# EAGLE design MCP23017_Aufsatz_Verzweiger_V2.1 (EAGLE 9.6.2)
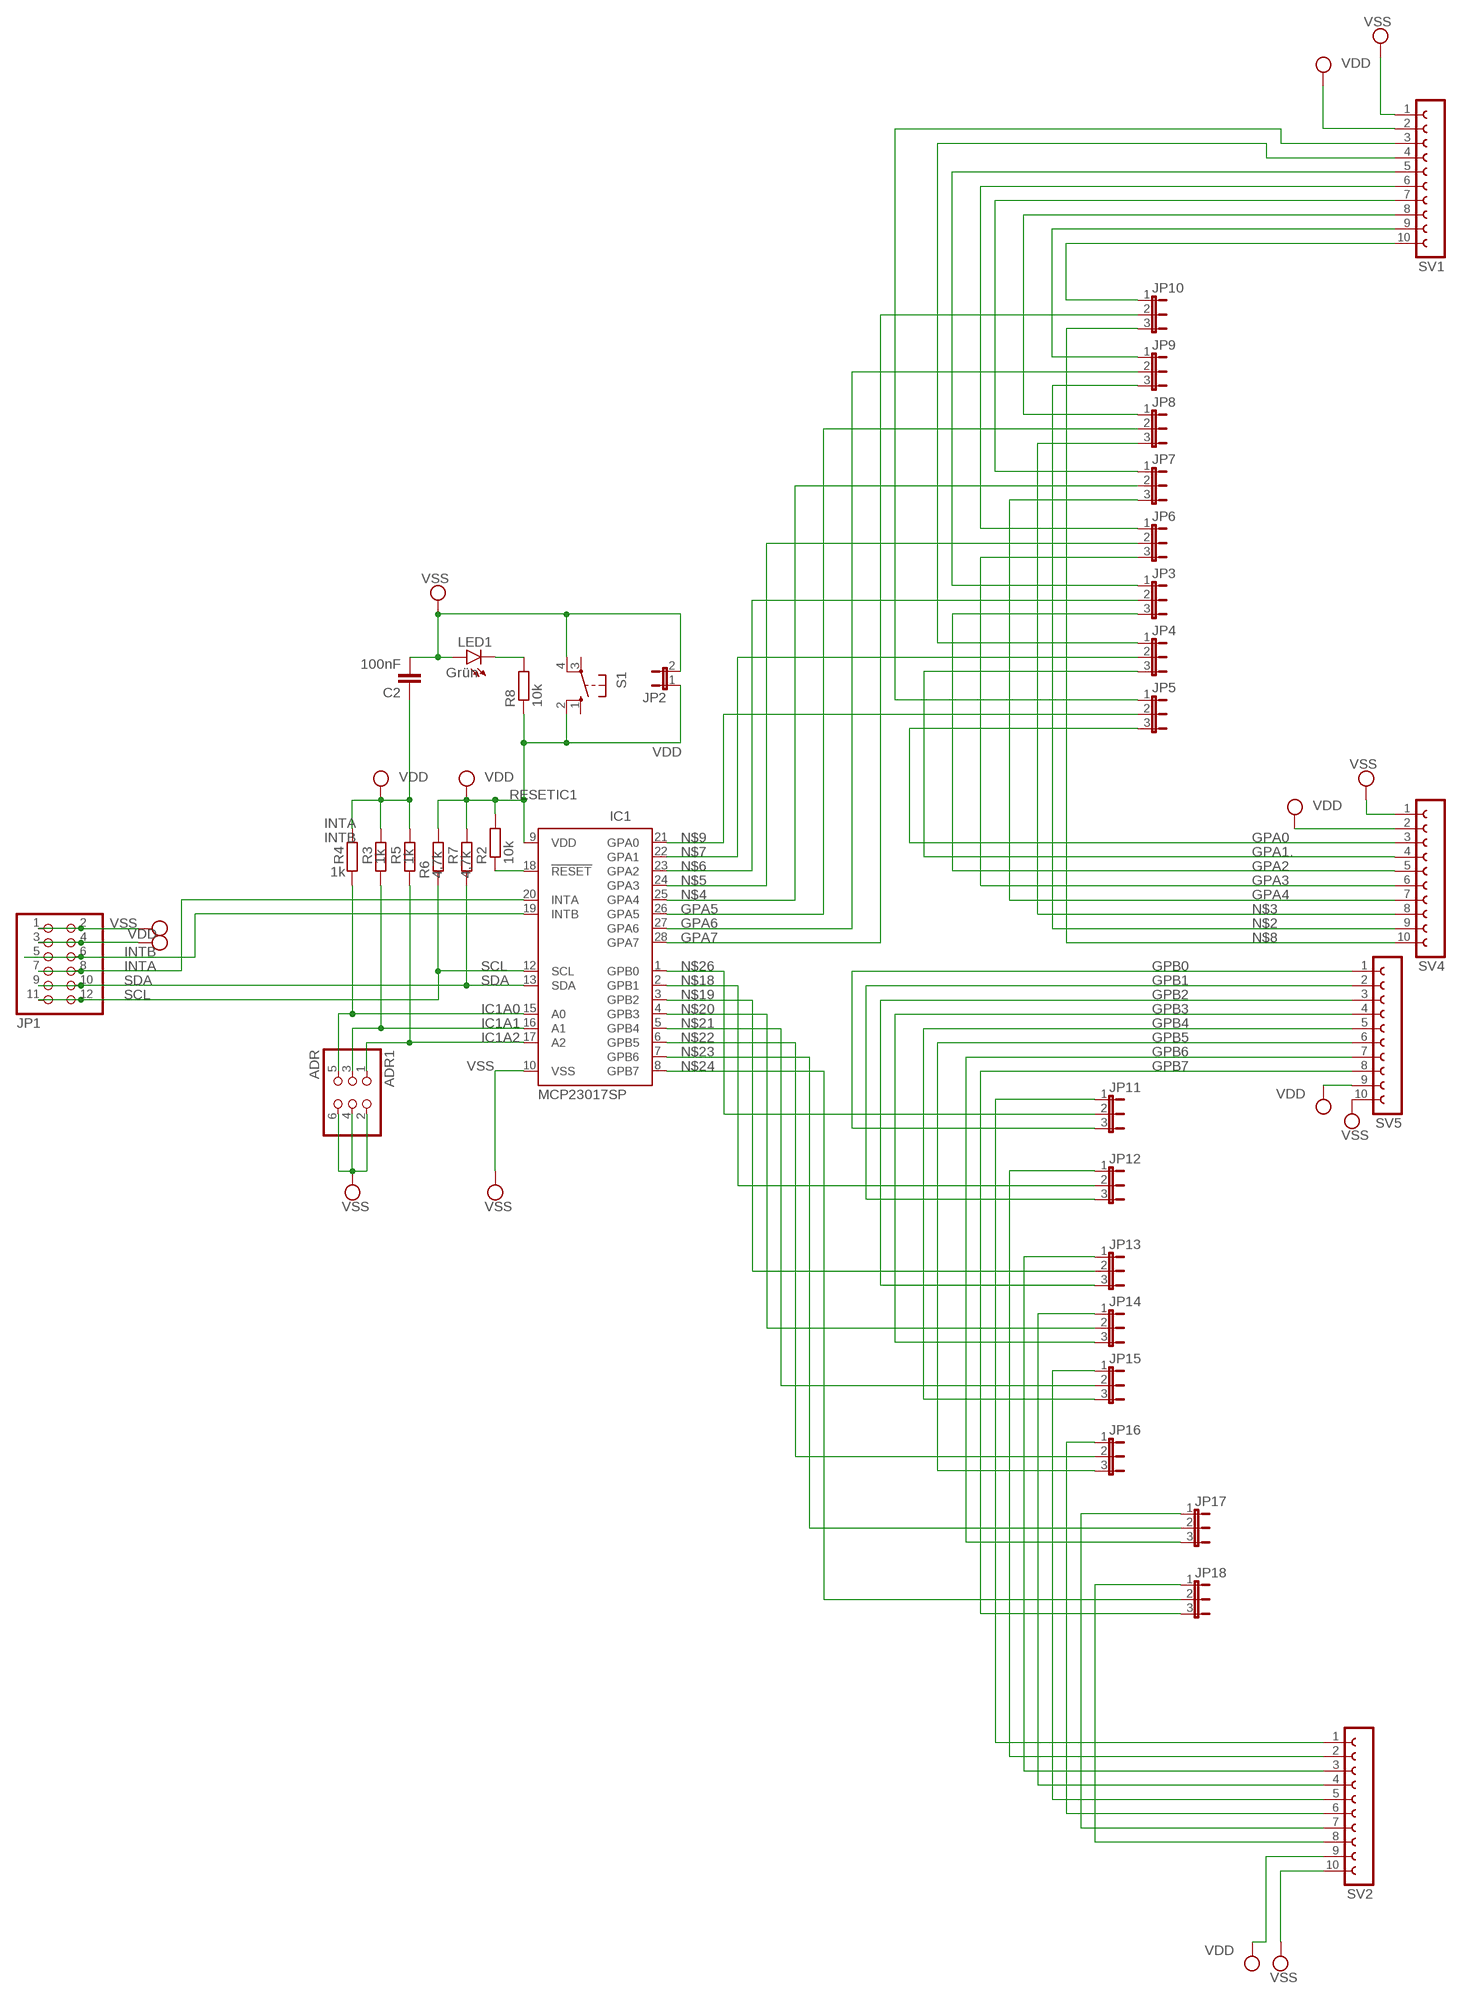
[diagram p0: schematic, sheet 1]

## Parts
ADR1  ADR  PINHD-2X3  [2X03]
C2  100nF  C-EU025-025X050  [C025-025X050]
IC1  MCP23017SP  [DIL28-3]
JP1  JP1  PINHD-2X6/90  [2X06/90]
JP2  JP1E  [JP1]
JP3  JP2E  [JP2]
JP4  JP2E  [JP2]
JP5  JP2E  [JP2]
JP6  JP2E  [JP2]
JP7  JP2E  [JP2]
JP8  JP2E  [JP2]
JP9  JP2E  [JP2]
JP10  JP2E  [JP2]
JP11  JP2E  [JP2]
JP12  JP2E  [JP2]
JP13  JP2E  [JP2]
JP14  JP2E  [JP2]
JP15  JP2E  [JP2]
JP16  JP2E  [JP2]
JP17  JP2E  [JP2]
JP18  JP2E  [JP2]
LED1  Grün  LED3MM  [LED3MM]
R2  10k  R-EU_0207/10  [0207/10]
R3  1k  R-EU_0207/10  [0207/10]
R4  1k  R-EU_0207/10  [0207/10]
R5  1k  R-EU_0207/10  [0207/10]
R6  4,7k  R-EU_0207/10  [0207/10]
R7  4,7k  R-EU_0207/10  [0207/10]
R8  10k  R-EU_0207/10  [0207/10]
S1  10-XX  [B3F-10XX]
SV1  FE10-1  [FE10]
SV2  FE10-1  [FE10]
SV4  FE10-1  [FE10]
SV5  FE10-1  [FE10]

## Nets
GPA0: JP5.3 SV4.3
GPA1.: JP4.3 SV4.4
GPA2: JP3.3 SV4.5
GPA3: JP6.3 SV4.6
GPA4: JP7.3 SV4.7
GPA5: IC1.26(GPA5) JP8.2
GPA6: IC1.27(GPA6) JP9.2
GPA7: IC1.28(GPA7) JP10.2
GPB0: JP11.3 SV5.1
GPB1: JP12.3 SV5.2
GPB2: JP13.3 SV5.3
GPB3: JP14.3 SV5.4
GPB4: JP15.3 SV5.5
GPB5: JP16.3 SV5.6
GPB6: JP17.3 SV5.7
GPB7: JP18.3 SV5.8
IC1A0: ADR1.5 IC1.15(A0) R4.1
IC1A1: ADR1.3 IC1.16(A1) R3.1
IC1A2: ADR1.1 IC1.17(A2) R5.1
INTA: IC1.20(INTA) JP1.7 JP1.8
INTB: IC1.19(INTB) JP1.5 JP1.6
N$1: LED1.K(C) R8.2
N$2: JP9.3 SV4.9
N$3: JP8.3 SV4.8
N$4: IC1.25(GPA4) JP7.2
N$5: IC1.24(GPA3) JP6.2
N$6: IC1.23(GPA2) JP3.2
N$7: IC1.22(GPA1) JP4.2
N$8: JP10.3 SV4.10
N$9: IC1.21(GPA0) JP5.2
N$10: JP10.1 SV1.10
N$11: JP9.1 SV1.9
N$12: JP8.1 SV1.8
N$13: JP7.1 SV1.7
N$14: JP6.1 SV1.6
N$15: JP3.1 SV1.5
N$16: JP4.1 SV1.4
N$17: JP5.1 SV1.3
N$18: IC1.2(GPB1) JP12.2
N$19: IC1.3(GPB2) JP13.2
N$20: IC1.4(GPB3) JP14.2
N$21: IC1.5(GPB4) JP15.2
N$22: IC1.6(GPB5) JP16.2
N$23: IC1.7(GPB6) JP17.2
N$24: IC1.8(GPB7) JP18.2
N$25: JP11.1 SV2.1
N$26: IC1.1(GPB0) JP11.2
N$27: JP12.1 SV2.2
N$28: JP13.1 SV2.3
N$29: JP14.1 SV2.4
N$30: JP15.1 SV2.5
N$31: JP16.1 SV2.6
N$32: JP17.1 SV2.7
N$33: JP18.1 SV2.8
RESETIC1: IC1.18(!RESET) R2.1
SCL: IC1.12(SCL) JP1.11 JP1.12 R6.1
SDA: IC1.13(SDA) JP1.9 JP1.10 R7.1
VDD: C2.1 IC1.9(VDD) JP1.3 JP1.4 JP2.1 R2.2 R3.2 R4.2 R5.2 R6.2 R7.2 R8.1 S1.2(S1) SV1.2 SV2.9 SV4.2 SV5.9
VSS: ADR1.2 ADR1.4 ADR1.6 C2.2 IC1.10(VSS) JP1.1 JP1.2 JP2.2 LED1.A S1.4(P1) SV1.1 SV2.10 SV4.1 SV5.10
Unconnected: S1.1(S) S1.3(P)

## Library data of the parts
ADR1 = pinhead:PINHD-2X3: PIN HEADER
C2 = rcl:C-EU: CAPACITOR, European symbol; SPICEPREFIX: C
IC1 = microchip:MCP23017: http://ww1.microchip.com/downloads/en/DeviceDoc/21952a.pdf Source: http://ww1.microchip.com/downloads/en/DeviceDoc/21952a.pdf; MF: MICROCHIP; MPN: MCP23017-E/SP; OC_FARNELL: 1332088; OC_NEWARK: 31K2959
JP1 = pinhead:PINHD-2X6: PIN HEADER
JP2 = jumper:JP1E: JUMPER
JP3-JP18 = jumper:JP2E: JUMPER
LED1 = led:LED: LED OSRAM: - CHIPLED LG R971, LG N971, LY N971, LG Q971, LY Q971, LO R971, LY R971 LH N974, LH R974 LS Q976, LO Q976, LY Q976 LO Q996 - Hyper CHIPLED LW Q18S LB Q993, LB Q99A, LB R99A - SideLED LS A670, LO A670, LY A670, LG A670, LP A670 LB A673, LV A673, LT A673, LW A673 LH A674 LY A675 LS A676, LA A676, LO A676, LY A676, LW A676 LS A679, LY A679, LG A679 - Hyper Micro SIDELED® LS Y876, LA Y876, LO Y876, LY Y876 LT Y87S - SmartLED LW L88C, LW L88S LB L89C, LB L89S, LG L890 LS L89K, LO L89K, LY L89K LS L896, LA L896, LO L896, LY L896 - TOPLED LS T670, LO T670, LY T670, LG T670, LP T670 LSG T670, LSP T670, LSY T670, LOP T670, LYG T670 LG T671, LOG T671, LSG T671 LB T673, LV T673, LT T673, LW T673 LH T674 LS T676, LA T676, LO T676, LY T676, LB T676, LH T676, LSB T676, LW T676 LB T67C, LV T67C, LT T67C, LS T67K, LO T67K, LY T67K, LW E67C LS E67B, LA E67B, LO E67B, LY E67B, LB E67C, LV E67C, LT E67C LW T67C LS T679, LY T679, LG T679 LS T770, LO T770, LY T770, LG T770, LP T770 LB T773, LV T773, LT T773, LW T773 LH T774 LS E675, LA E675, LY E675, LS T675 LS T776, LA T776, LO T776, LY T776, LB T776 LHGB T686 LT T68C, LB T68C - Hyper Mini TOPLED® LB M676 - Mini TOPLED Santana® LG M470 LS M47K, LO M47K, LY M47K Source: http://www.osram.convergy.de LUXEON: - LUMILED® LXK2-PW12-R00, LXK2-PW12-S00, LXK2-PW14-U00, LXK2-PW14-V00 LXK2-PM12-R00, LXK2-PM12-S00, LXK2-PM14-U00 LXK2-PE12-Q00, LXK2-PE12-R00, LXK2-PE12-S00, LXK2-PE14-T00, LXK2-PE14-U00 LXK2-PB12-K00, LXK2-PB12-L00, LXK2-PB12-M00, LXK2-PB14-N00, LXK2-PB14-P00, LXK2-PB14-Q00 LXK2-PR12-L00, LXK2-PR12-M00, LXK2-PR14-Q00, LXK2-PR14-R00 LXK2-PD12-Q00, LXK2-PD12-R00, LXK2-PD12-S00 LXK2-PH12-R00, LXK2-PH12-S00 LXK2-PL12-P00, LXK2-PL12-Q00, LXK2-PL12-R00 Source: www.luxeon.com KINGBRIGHT: KA-3528ASYC Source: www.kingbright.com
R2-R8 = rcl:R-EU_: RESISTOR, European symbol; SPICEPREFIX: R
S1 = switch-omron:10-XX: OMRON SWITCH; MPN: B3F-1000; OC_FARNELL: 176432; OC_NEWARK: 36M3542
SV1 SV2 SV4 SV5 = con-lsta:FE10-1: FEMALE HEADER; OC_FARNELL: unknown; OC_NEWARK: unknown

## Board
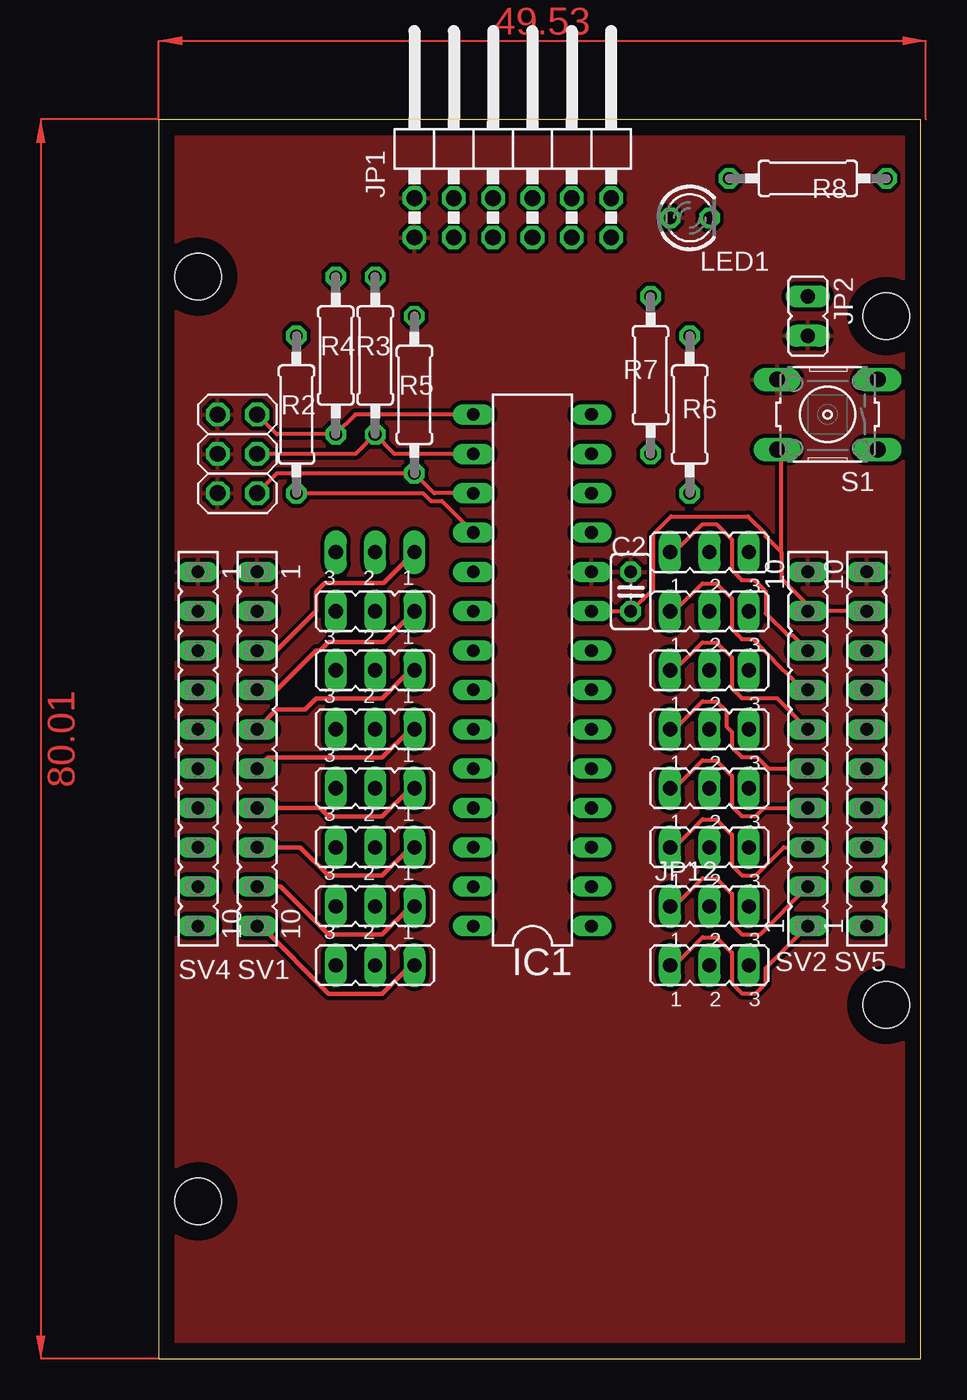
[diagram p1: board, top side]
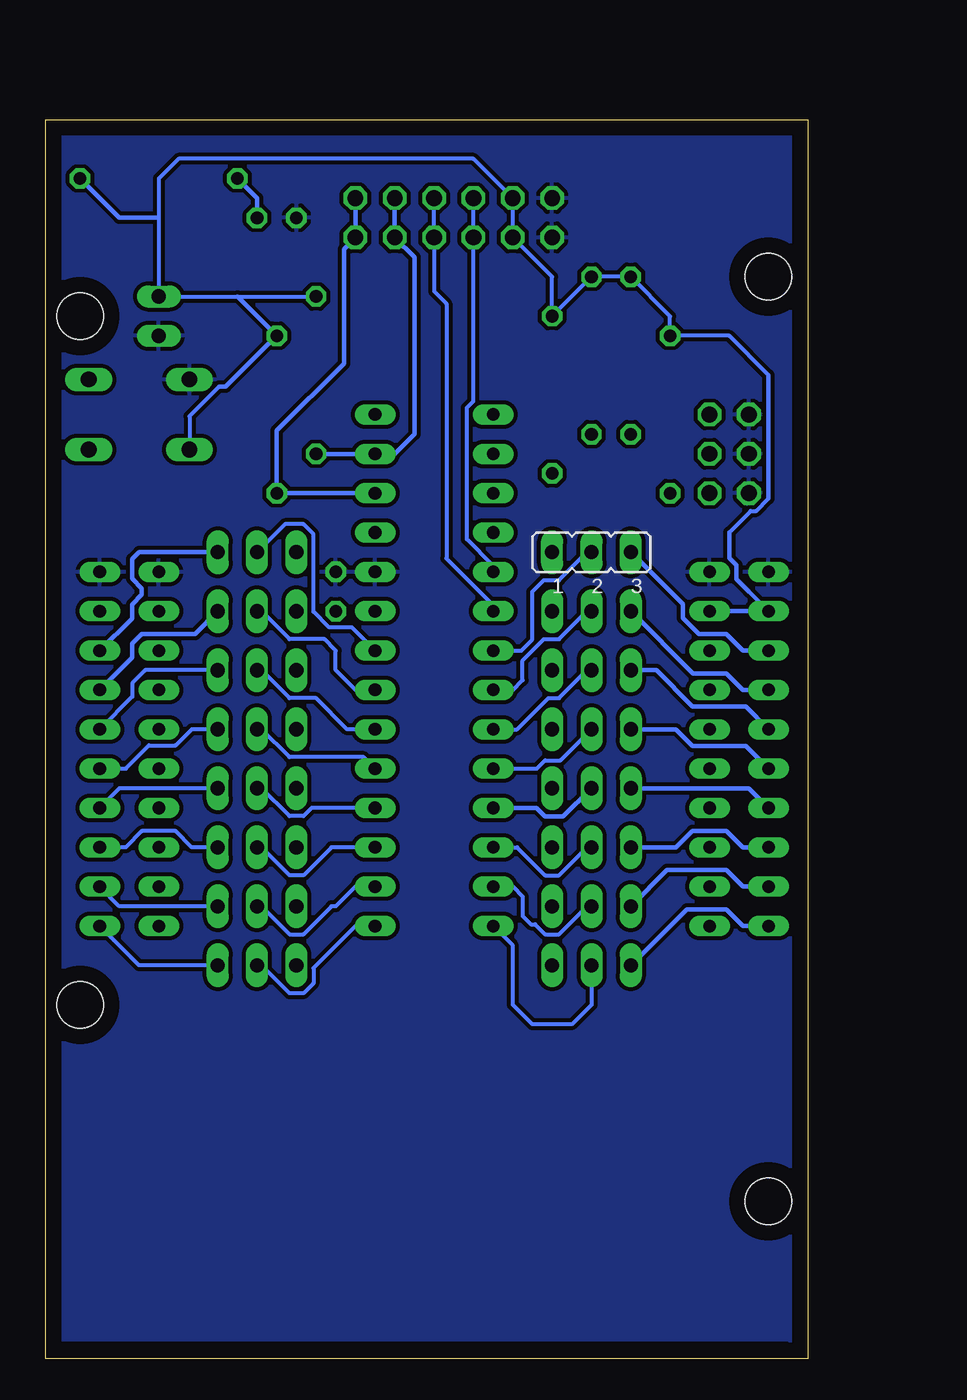
[diagram p2: board, bottom side, seen from below]

Size 49.2 x 80 mm. Coordinates in mm from the lower left corner, seen from the top.
Outline: 0,0 49.2,0 49.2,80 0,80 0,0
Copper layers (1*16): Top 0.035mm / dielectric 1.5mm / Bottom 0.035mm
Design rules "platinenbelichter": minimum track width 10mil, minimum drill 24mil, track to track 10mil, track to pad 10mil, pad to pad 10mil, via to via 10mil, smd to smd 10mil, copper to edge 40mil, drill to drill 8mil, minimum pad ring 10mil, minimum via ring 8mil, stop-mask expansion 10mil, vias tented up to drill 0mil, thermal gap 10mil
Holes 3 mm at 2.54,69.85 46.99,22.86 2.54,10.16 46.99,67.31

### Footprints (pad centres in the part's own frame; a part is rotated, then mirrored left to right if it is on the bottom)
2X03 = drill 1.016 octagon: 1 -2.54,-1.27; 2 -2.54,1.27; 3 0,-1.27; 4 0,1.27; 5 2.54,-1.27; 6 2.54,1.27
C025-025X050 = drill 0.813 octagon: 1 -1.27,0; 2 1.27,0
DIL28-3 = drill 0.813 long: 1 -16.51,-3.81; 2 -13.97,-3.81; 3 -11.43,-3.81; 4 -8.89,-3.81; 5 -6.35,-3.81; 6 -3.81,-3.81; 7 -1.27,-3.81; 8 1.27,-3.81; 9 3.81,-3.81; 10 6.35,-3.81; 11 8.89,-3.81; 12 11.43,-3.81; 13 13.97,-3.81; 14 16.51,-3.81; 15 16.51,3.81; 16 13.97,3.81; 17 11.43,3.81; 18 8.89,3.81; 19 6.35,3.81; 20 3.81,3.81; 21 1.27,3.81; 22 -1.27,3.81; 23 -3.81,3.81; 24 -6.35,3.81; 25 -8.89,3.81; 26 -11.43,3.81; 27 -13.97,3.81; 28 -16.51,3.81
2X06/90 = drill 1.016 octagon: 1 -6.35,-6.35; 2 -6.35,-3.81; 3 -3.81,-6.35; 4 -3.81,-3.81; 5 -1.27,-6.35; 6 -1.27,-3.81; 7 1.27,-6.35; 8 1.27,-3.81; 9 3.81,-6.35; 10 3.81,-3.81; 11 6.35,-6.35; 12 6.35,-3.81
JP1 = drill 0.914 long: 1 0,-1.27; 2 0,1.27
JP2 = drill 0.914 long: 1 -2.54,0; 2 0,0; 3 2.54,0
LED3MM = drill 0.813 octagon: A -1.27,0; K 1.27,0
0207/10 = drill 0.813 octagon: 1 -5.08,0; 2 5.08,0
B3F-10XX = drill 1.016 long: 1 -3.251,2.261; 2 3.251,2.261; 3 -3.251,-2.261; 4 3.251,-2.261
FE10 = drill 0.813 long: 1 -11.43,0; 2 -8.89,0; 3 -6.35,0; 4 -3.81,0; 5 -1.27,0; 6 1.27,0; 7 3.81,0; 8 6.35,0; 9 8.89,0; 10 11.43,0

### Placement (x,y rotation side)
ADR1  5.08,58.42 90 top
C2  30.48,49.53 90 top
IC1  24.13,44.45 90 top
JP1  22.86,78.74 0 top
JP2  41.91,67.31 180 top
JP3  13.97,44.45 180 top
JP4  13.97,48.26 180 top
JP5  13.97,52.07 0 bottom
JP6  13.97,40.64 180 top
JP7  13.97,36.83 180 top
JP8  13.97,33.02 180 top
JP9  13.97,29.21 180 top
JP10  13.97,25.4 180 top
JP11  35.56,25.4 0 top
JP12  35.56,29.21 0 top
JP13  35.56,33.02 0 top
JP14  35.56,36.83 0 top
JP15  35.56,40.64 0 top
JP16  35.56,44.45 0 top
JP17  35.56,48.26 0 top
JP18  35.56,52.07 0 top
LED1  34.29,73.66 0 top
R2  8.89,60.96 90 top
R3  13.97,64.77 90 top
R4  11.43,64.77 90 top
R5  16.51,62.23 90 top
R6  34.29,60.96 90 top
R7  31.75,63.5 90 top
R8  41.91,76.2 180 top
S1  43.18,60.96 180 top
SV1  6.35,39.37 270 top
SV2  41.91,39.37 90 top
SV4  2.54,39.37 270 top
SV5  45.72,39.37 90 top

### Tracks (layer width: path | path; a pad name or v marks a point on that pad's centre or on a via)
GPA0
  Bottom 0.305: JP5.3 8.08,48.72 8.08,47.82 7.05,46.79 5.25,46.79 4.18,45.72 SV4.3
GPA1.
  Bottom 0.305: JP4.3 7.42,44.25 5.25,44.25 4.18,43.18 SV4.4
GPA2
  Bottom 0.305: SV4.5 4.01,42.11 7.45,42.11 9.79,44.45 JP3.3
GPA3
  Bottom 0.305: SV4.6 4.01,39.57 7.45,39.57 8.52,40.64 JP6.3
GPA4
  Bottom 0.305: SV4.7 3.81,36.83 JP7.3
GPA5
  Bottom 0.254: IC1.26 18.77,33.02 16.96,31.22 16.06,31.22 14.25,33.02 JP8.2
GPA6
  Bottom 0.254: JP9.2 14.25,29.21 16.06,27.41 16.96,27.41 17.6,28.05 17.89,28.05 18.41,28.57 18.41,29.84 19.05,30.48 IC1.27
GPA7
  Bottom 0.254: IC1.28 19.05,26.67 19.05,22.86 17.78,21.59 15.24,21.59 13.97,22.86 JP10.2
GPB0
  Bottom 0.254: JP11.3 43.18,25.4 SV5.1
GPB1
  Bottom 0.254: JP12.3 44.45,29.21 SV5.2
GPB2
  Bottom 0.254: JP13.3 39.78,33.02 40.82,34.06 43,34.06 44.04,33.02 SV5.3
GPB3
  Bottom 0.254: JP14.3 44.45,36.83 SV5.4
GPB4
  Bottom 0.254: JP15.3 39.78,40.64 40.82,39.6 42.55,39.6 44.04,38.1 SV5.5
GPB5
  Bottom 0.254: SV5.6 43.61,42.75 43.61,43.61 42.77,44.45 JP16.3
GPB6
  Bottom 0.305: JP17.3 39.57,46.79 43.01,46.79 43.64,46.16 43.64,45.26 SV5.7
GPB7
  Bottom 0.305: SV5.8 43.64,47.8 43.64,48.7 43.01,49.33 43.01,49.73 43.64,50.36 43.64,51.61 43.18,52.07 JP18.3
IC1A0
  Top 0.254: IC1.15 12.7,60.96 R4.1 7.62,59.69 ADR1.5
IC1A1
  Top 0.254: IC1.16 15.24,58.42 R3.1 12.7,58.42 ADR1.3
IC1A2
  Top 0.254: IC1.17 17.78,55.88 R5.1 7.62,57.15 ADR1.1
INTA
  Bottom 0.254: IC1.20 20.32,48.67 23.33,51.68 23.33,68.11 24.13,68.91 JP1.7 JP1.8
INTB
  Bottom 0.254: IC1.19 20.32,51.21 22.02,52.91 22.02,61.39 21.59,61.82 JP1.5 JP1.6
N$1
  Bottom 0.305: LED1.K 35.56,74.93 R8.2
N$2
  Bottom 0.305: SV4.9 4.18,30.48 5.25,31.55 9.09,31.55 JP9.3
N$3
  Bottom 0.305: SV4.8 4.18,33.02 5.25,34.09 7.45,34.09 8.52,33.02 JP8.3
N$4
  Bottom 0.305: IC1.25 17.53,35.56 16.97,35 15.8,35 JP7.2
N$5
  Bottom 0.254: IC1.24 17.5,38.1 16.96,38.63 15.98,38.63 JP6.2
N$6
  Bottom 0.254: JP3.2 14.25,44.45 16.06,42.65 16.76,42.65 18.77,40.64 IC1.23
N$7
  Bottom 0.254: JP4.2 14.25,48.26 16.06,46.46 17.04,46.46 18.41,45.09 18.41,43.81 19.05,43.18 IC1.22
N$8
  Bottom 0.305: SV4.10 4.18,27.94 5.25,29.01 7.82,29.01 JP10.3
N$9
  Bottom 0.254: JP5.2 14.25,52.07 16.06,50.27 17.04,50.27 17.78,49.53 17.78,46.44 18.5,45.72 IC1.21
N$10
  Top 0.305: SV1.10 6.6,27.94 10.97,23.57 14.43,23.57 16.26,25.4 JP10.1
N$11
  Top 0.305: SV1.9 7.87,30.48 10.97,27.38 14.43,27.38 16.26,29.21 JP9.1
N$12
  Top 0.305: SV1.8 9.14,33.02 10.97,31.19 14.43,31.19 16.26,33.02 JP8.1
N$13
  Top 0.305: JP7.1 16.26,36.83 14.43,35 10.97,35 10.41,35.56 SV1.7
N$14
  Top 0.305: JP6.1 16.26,40.64 14.43,38.81 7.06,38.81 SV1.6
N$15
  Top 0.305: JP3.1 16.26,44.45 14.43,42.62 10.16,42.62 9.45,41.91 7.62,41.91 SV1.5
N$16
  Top 0.305: JP4.1 14.53,46.28 10.97,46.28 10.41,45.72 10.16,45.72 7.62,43.18 SV1.4
N$17
  Top 0.305: JP5.1 14.53,50.09 10.72,50.09 10.16,49.53 10.16,48.26 7.62,45.72 SV1.3
N$18
  Bottom 0.254: JP12.2 35.28,29.21 33.47,27.41 32.57,27.41 30.76,29.21 30.48,29.21 29.21,30.48 IC1.2
N$19
  Bottom 0.254: IC1.3 30.76,33.02 32.57,31.22 33.47,31.22 35.28,33.02 JP13.2
N$20
  Bottom 0.254: JP14.2 35.28,36.83 33.47,35.03 32.57,35.03 32.03,35.56 IC1.4
N$21
  Bottom 0.254: JP15.2 35.28,40.64 33.47,38.84 28.68,38.84 IC1.5
N$22
  Bottom 0.254: JP16.2 35.28,44.45 33.47,42.65 31.75,42.65 29.74,40.64 IC1.6
N$23
  Bottom 0.254: JP17.2 35.28,48.26 33.47,46.46 31.22,46.46 30.48,45.72 30.48,44.45 29.21,43.18 IC1.7
N$24
  Bottom 0.254: JP18.2 33.76,53.87 32.57,53.87 31.93,53.23 31.93,48.23 30.91,47.22 29.44,47.22 IC1.8
N$25
  Top 0.254: JP11.1 33.3,25.4 35.11,27.2 36.01,27.2 37.01,26.21 37.01,24.24 37.65,23.6 38.55,23.6 39.19,24.24 39.19,25.22 SV2.1
N$26
  Bottom 0.254: IC1.1 29.21,27.94 31.93,25.22 31.93,24.24 32.57,23.6 33.47,23.6 35.28,25.4 JP11.2
N$27
  Top 0.254: JP12.1 33.3,29.21 35.11,31.01 36.01,31.01 37.01,30.02 37.01,28.05 37.65,27.41 38.84,27.41 SV2.2
N$28
  Top 0.254: JP13.1 33.3,33.02 35.11,34.82 36.01,34.82 37.01,33.83 37.01,31.86 37.65,31.22 38.55,31.22 40.36,33.02 SV2.3
N$29
  Top 0.254: JP14.1 33.3,36.83 35.11,38.63 36.01,38.63 37.01,37.64 37.01,35.67 37.65,35.03 38.55,35.03 39.09,35.56 SV2.4
N$30
  Top 0.254: JP15.1 33.3,40.64 35.11,42.44 36.01,42.44 36.65,41.8 36.65,40.82 37.01,40.46 37.01,39.48 37.65,38.84 38.63,38.84 39.37,38.1 SV2.5
N$31
  Top 0.254: JP16.1 33.3,44.45 35.11,46.25 36.01,46.25 37.01,45.26 37.01,43.29 37.65,42.65 39.9,42.65 SV2.6
N$32
  Top 0.254: SV2.7 41.38,43.71 41.06,43.71 39.7,45.08 39.7,45.11 38.35,46.46 37.65,46.46 37.01,47.1 37.01,49.07 36.01,50.06 35.11,50.06 33.3,48.26 JP17.1
N$33
  Top 0.254: JP18.1 33.3,52.07 35.11,53.87 36.01,53.87 37.01,52.88 37.01,50.91 37.65,50.27 38.46,50.27 39.19,49.53 39.19,48.13 40.61,46.71 40.92,46.71 SV2.8
RESETIC1
  Top 0.254: R2.1 17.06,55.88 17.57,55.37 18.29,55.37 IC1.18
SCL
  Bottom 0.305: IC1.12 R6.1 34.29,59.92 29.96,64.25 29.96,71.64 JP1.11 JP1.12
SDA
  Bottom 0.305: R7.1 IC1.13 26.67,58.42 25.4,59.69 25.4,71.12 JP1.9 JP1.10
VDD
  Top 0.254: SV5.9 SV2.9 41.91,48.67 40.21,50.37 40.21,52.07 | IC1.9 C2.1 31.93,49.71 31.93,53.23 33.08,54.38 38.04,54.38 39.19,53.23 39.19,53.09 40.21,52.07 | 40.21,52.07 40.21,58.42 S1.2
  Bottom 0.254: 3.81,49.53 SV4.2 | S1.2 39.93,60.84 38.02,62.75 | R7.2 36.83,68.58 JP2.1 41.91,73.66 41.91,76.2 40.64,77.47 21.59,77.47 JP1.4 JP1.3 16.51,69.85 R5.2 R3.2 R4.2 8.89,67.31 R2.2 5.08,66.04 2.54,63.5 | 5.08,53.34 3.68,54.74 3.34,54.74 2.54,55.53
  Bottom 0.305: 2.54,55.53 2.54,63.5 | 36.83,68.58 R6.2 37.58,62.75 38.02,62.75 | R8.1 44.45,73.66 41.91,73.66 | SV4.2 SV1.2 | 5.08,53.34 5.08,51.7 4.62,51.24 4.62,50.34 3.81,49.53
VSS
  pour Bottom: 0,80.01 49.53,80.01 49.53,1.27 1.27,1.27 0,0
  pour Top: 0,80.01 49.53,80.01 49.53,0 0,0
(copper drawn outside any net)
  shapes: Top area x2

### Text on the board
tDocu: MCP23017Aufsatz Verzweiger / (universal) / Version V2.1